# EAGLE schematic AD7173 (EAGLE 6.5.0)
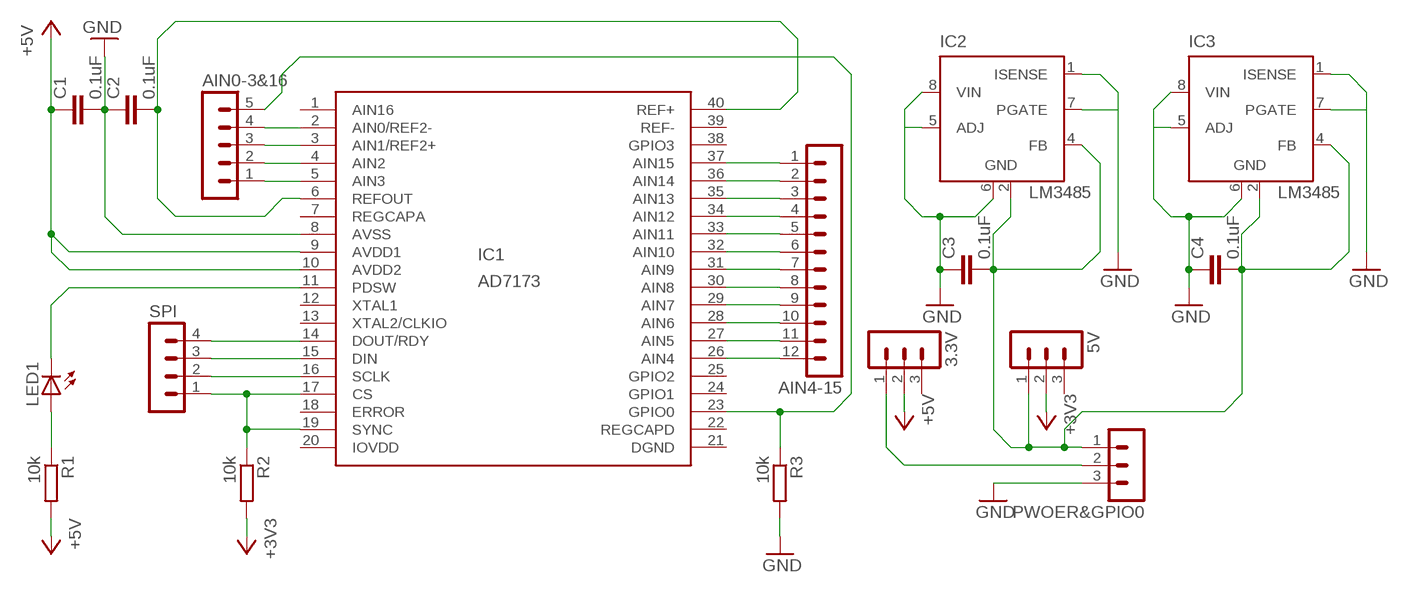
[diagram p0: schematic, sheet 1]

## Parts
3.3V  MA03-1  [MA03-1]
5V  MA03-1  [MA03-1]
AIN0-3&16  MA05-1  [MA05-1]
AIN4-15  MA12-1  [MA12-1]
C1  0.1uF  C-EUC0402  [C0402]
C2  0.1uF  C-EUC0402  [C0402]
C3  0.1uF  C-EUC0402  [C0402]
C4  0.1uF  C-EUC0402  [C0402]
IC1  AD7173  [LFCSP_WQ6X6MM]
IC2  LM3485  [MSOP08]
IC3  LM3485  [MSOP08]
LED1  LEDCHIP-LED0603  [CHIP-LED0603]
PWOER&GPIO0  MA03-1  [MA03-1]
R1  10k  R-EU_R0402  [R0402]
R2  10k  R-EU_R0402  [R0402]
R3  10k  R-EU_R0402  [R0402]
SPI  MA04-1  [MA04-1]

## Nets
+3V3: 5V.2 R2.2
+5V: 3.3V.2 C1.1 IC1.9(AVDD1) IC1.10(AVDD2) R1.2
GND: C1.2 C2.1 C3.1 C4.1 IC1.8(AVSS) IC2.1(ISENSE) IC2.5(ADJ) IC2.6(GND) IC2.7(PGATE) IC2.8(VIN) IC3.1(ISENSE) IC3.5(ADJ) IC3.6(GND) IC3.7(PGATE) IC3.8(VIN) PWOER&GPIO0.3 R3.2
N$1: LED1.A R1.1
N$3: IC1.17(CS) IC1.19(SYNC) R2.1 SPI.1
N$4: AIN4-15.1 IC1.37(AIN15)
N$5: AIN0-3&16.5 IC1.23(GPIO0) R3.1
N$6: C2.2 IC1.6(REFOUT) IC1.40(REF+)
N$7: AIN4-15.2 IC1.36(AIN14)
N$8: AIN4-15.3 IC1.35(AIN13)
N$9: AIN4-15.4 IC1.34(AIN12)
N$10: AIN4-15.5 IC1.33(AIN11)
N$11: AIN4-15.6 IC1.32(AIN10)
N$12: AIN4-15.7 IC1.31(AIN9)
N$13: AIN4-15.8 IC1.30(AIN8)
N$14: AIN4-15.9 IC1.29(AIN7)
N$15: AIN4-15.10 IC1.28(AIN6)
N$16: AIN4-15.11 IC1.27(AIN5)
N$17: AIN4-15.12 IC1.26(AIN4)
N$18: AIN0-3&16.1 IC1.5(AIN3)
N$19: AIN0-3&16.2 IC1.4(AIN2)
N$20: AIN0-3&16.3 IC1.3(AIN1/REF2+)
N$21: AIN0-3&16.4 IC1.2(AIN0/REF2-)
N$22: 3.3V.1 PWOER&GPIO0.2
N$23: IC1.14(DOUT/RDY) SPI.4
N$24: IC1.15(DIN) SPI.3
N$25: IC1.16(SCLK) SPI.2
N$27: 5V.1 C3.2 C4.2 IC2.2(GND) IC2.4(FB) IC3.2(GND) IC3.4(FB) PWOER&GPIO0.1
SPI: IC1.11(PDSW) LED1.C
Unconnected: 3.3V.3 5V.3 IC1.7(REGCAPA) IC1.12(XTAL1) IC1.13(XTAL2/CLKIO) IC1.18(ERROR) IC1.20(IOVDD) IC1.38(GPIO3)

## Power pins joined to a net without a drawn wire
AIN16: IC1.1(AIN16)
DGND: IC1.21(DGND)
GPIO1: IC1.24(GPIO1)
GPIO2: IC1.25(GPIO2)
REF-: IC1.39(REF-)
REGCAPD: IC1.22(REGCAPD)

## Library data of the parts
3.3V 5V PWOER&GPIO0 = con-lstb:MA03-1: PIN HEADER; OC_FARNELL: unknown; OC_NEWARK: unknown
AIN0-3&16 = con-lstb:MA05-1: PIN HEADER; OC_FARNELL: unknown; OC_NEWARK: unknown
AIN4-15 = con-lstb:MA12-1: PIN HEADER; OC_FARNELL: unknown; OC_NEWARK: unknown
C1-C4 = rcl:C-EU: CAPACITOR, European symbol
IC1 = AD7173:AD7173: IEEE 802.15.4? 2.4 GHz RF Transceiver Source: http://ww1.microchip.com/downloads/en/DeviceDoc/39776a.pdf; MPN: MRF24J40-I/ML; OC_FARNELL: 1436019; OC_NEWARK: 17M0699
IC2 IC3 = linear:LM3485: Hysteretic PFET Buck Controller Source: http://cache.national.com/ds/LM/LM3485.pdf
LED1 = led:LED: LED OSRAM: - CHIPLED LG R971, LG N971, LY N971, LG Q971, LY Q971, LO R971, LY R971 LH N974, LH R974 LS Q976, LO Q976, LY Q976 LO Q996 - Hyper CHIPLED LW Q18S LB Q993, LB Q99A, LB R99A - SideLED LS A670, LO A670, LY A670, LG A670, LP A670 LB A673, LV A673, LT A673, LW A673 LH A674 LY A675 LS A676, LA A676, LO A676, LY A676, LW A676 LS A679, LY A679, LG A679 - Hyper Micro SIDELED® LS Y876, LA Y876, LO Y876, LY Y876 LT Y87S - SmartLED LW L88C, LW L88S LB L89C, LB L89S, LG L890 LS L89K, LO L89K, LY L89K LS L896, LA L896, LO L896, LY L896 - TOPLED LS T670, LO T670, LY T670, LG T670, LP T670 LSG T670, LSP T670, LSY T670, LOP T670, LYG T670 LG T671, LOG T671, LSG T671 LB T673, LV T673, LT T673, LW T673 LH T674 LS T676, LA T676, LO T676, LY T676, LB T676, LH T676, LSB T676, LW T676 LB T67C, LV T67C, LT T67C, LS T67K, LO T67K, LY T67K, LW E67C LS E67B, LA E67B, LO E67B, LY E67B, LB E67C, LV E67C, LT E67C LW T67C LS T679, LY T679, LG T679 LS T770, LO T770, LY T770, LG T770, LP T770 LB T773, LV T773, LT T773, LW T773 LH T774 LS E675, LA E675, LY E675, LS T675 LS T776, LA T776, LO T776, LY T776, LB T776 LHGB T686 LT T68C, LB T68C - Hyper Mini TOPLED® LB M676 - Mini TOPLED Santana® LG M470 LS M47K, LO M47K, LY M47K Source: http://www.osram.convergy.de LUXEON: - LUMILED® LXK2-PW12-R00, LXK2-PW12-S00, LXK2-PW14-U00, LXK2-PW14-V00 LXK2-PM12-R00, LXK2-PM12-S00, LXK2-PM14-U00 LXK2-PE12-Q00, LXK2-PE12-R00, LXK2-PE12-S00, LXK2-PE14-T00, LXK2-PE14-U00 LXK2-PB12-K00, LXK2-PB12-L00, LXK2-PB12-M00, LXK2-PB14-N00, LXK2-PB14-P00, LXK2-PB14-Q00 LXK2-PR12-L00, LXK2-PR12-M00, LXK2-PR14-Q00, LXK2-PR14-R00 LXK2-PD12-Q00, LXK2-PD12-R00, LXK2-PD12-S00 LXK2-PH12-R00, LXK2-PH12-S00 LXK2-PL12-P00, LXK2-PL12-Q00, LXK2-PL12-R00 Source: www.luxeon.com KINGBRIGHT: KA-3528ASYC Source: www.kingbright.com
R1-R3 = rcl:R-EU_: RESISTOR, European symbol
SPI = con-lstb:MA04-1: PIN HEADER; OC_FARNELL: unknown; OC_NEWARK: unknown

## Net classes
0 default: clearance 0.205 mm